# Altium project Project.PrjPCB
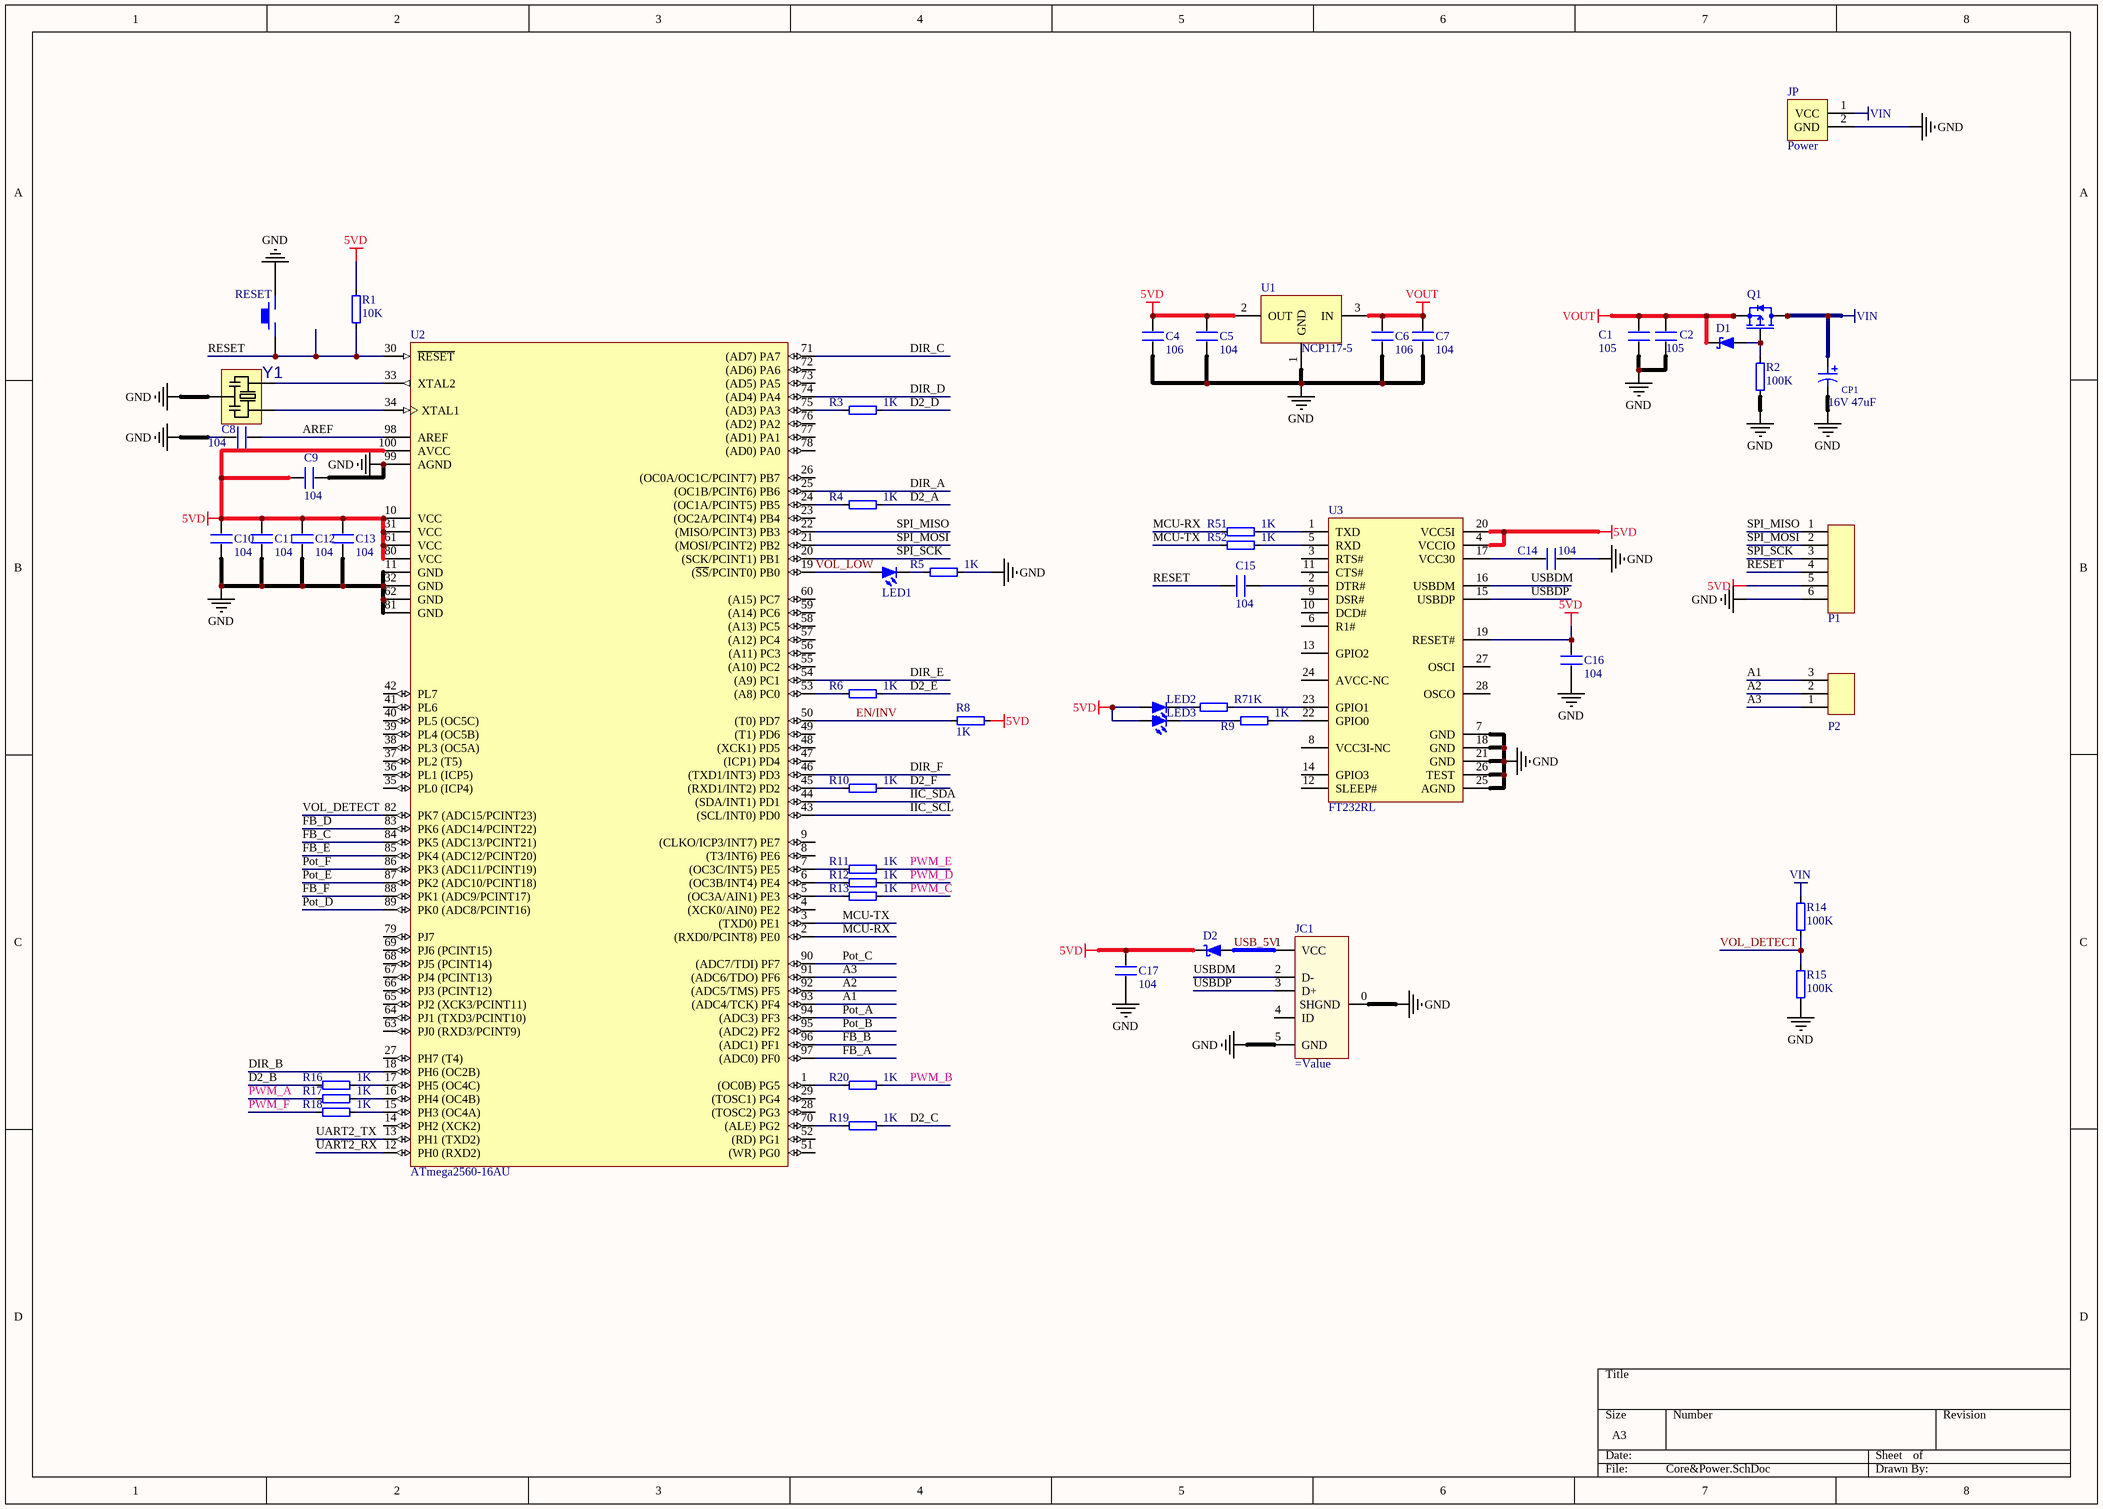
[diagram p0: Core&Power.SchDoc]
2 sheets, 132 parts. Net scope: global (net labels, ports and power ports of the same name join across sheets).
Board file: Motor.PcbDoc
Sheets:
  Core&Power.SchDoc
  Motor.SchDoc

## Sheet Core&Power.SchDoc
size A3

### Parts
C1  105  [SM0603C]
C2  105  [SM0603C]
C4  106  [SM0603C]
C5  104  [SM0603C]
C6  106  [SM0603C]
C7  104  [SM0603C]
C8  104  [SM0603C]
C9  104  [SM0603C]
C10  104  [SM0603C]
C11  104  [SM0603C]
C12  104  [SM0603C]
C13  104  [SM0603C]
C14  104  [SM0603C]
C15  104  [SM0603C]
C16  104  [SM0603C]
C17  104  [SM0603C]
CP1  16V 47uF  [SMD5-Al]
D1  B5819W  [SOD-323]  (value not drawn)
D2  B5819W  [SOD-323]  (value not drawn)
JC1  (no value)  [MICRO-USB2]
JP  Power  [AM1015-M]
LED1  Blue LED  [SM0805LED]  (value not drawn)
LED2  Blue LED  [SM0805LED]  (value not drawn)
LED3  Blue LED  [SM0805LED]  (value not drawn)
P1  JC6  [HDR1X6]  (value not drawn)
P2  JC3  [HDR1X3]  (value not drawn)
Q1  (no value)
R1  10K  [SM0603R]
R2  100K  [SM0603R]
R3  1K  [SM0603R]
R4  1K  [SM0603R]
R5  1K  [SM0603R]
R6  1K  [SM0603R]
R7  1K  [SM0603R]
R8  1K  [SM0603R]
R9  1K  [SM0603R]
R10  1K  [SM0603R]
R11  1K  [SM0603R]
R12  1K  [SM0603R]
R13  1K  [SM0603R]
R14  100K  [SM0603R]
R15  100K  [SM0603R]
R16  1K  [SM0603R]
R17  1K  [SM0603R]
R18  1K  [SM0603R]
R19  1K  [SM0603R]
R20  1K  [SM0603R]
R51  1K  [SM0603R]
R52  1K  [SM0603R]
RESET  KEY_M  [SPNO_SMD]  (value not drawn)
U1  NCP117-5  [SOT223-4]
U2  ATmega2560-16AU  [100A_N]
U3  FT232RL  [SSOP-28]
Y1  CSTCE16M0V53-R0  [OSC_CSTCE16M0V53-R0]  (value not drawn)

### Nets
5VD: C4.2 C5.2 C9.2 C10.1 C11.1 C12.1 C13.1 C16.2 C17.2 D2.1(C) LED2.2(A) LED3.2(A) P1.5 R1.2 R8.1 U1.2(OUT) U2.10(VCC) U2.31(VCC) U2.61(VCC) U2.80(VCC) U2.100(AVCC) U3.4(VCCIO) U3.19(RESET#) U3.20(VCC5I)
GND: C1.1 C2.1 C4.1 C5.1 C6.1 C7.1 C8.1 C9.1 C10.2 C11.2 C12.2 C13.2 C14.2 C16.1 C17.1 CP1.2 JC1.0(SHGND) JC1.5(GND) JP.2(GND) P1.6 R2.1 R5.2 R15.1 RESET.1 U1.1(GND) U2.11(GND) U2.32(GND) U2.62(GND) U2.81(GND) U2.99(AGND) U3.7(GND) U3.18(GND) U3.21(GND) U3.25(AGND) U3.26(TEST) Y1.2
VIN: CP1.1 JP.1(VCC) Q1.5(D) Q1.6(D) Q1.7(D) Q1.8(D) R14.2
VOUT: C1.2 C2.2 C6.2 C7.2 D1.1(C) Q1.1(S) Q1.2(S) Q1.3(S) U1.3(IN)
A1: P2.3 U2.93((ADC4/TCK)_PF4)
A2: P2.2 U2.92((ADC5/TMS)_PF5)
A3: P2.1 U2.91((ADC6/TDO)_PF6)
AREF: C8.2 U2.98(AREF)
D2_A: R4.2
D2_B: R16.2
D2_C: R19.2
D2_D: R3.2
D2_E: R6.2
D2_F: R10.2
DIR_A: U2.25((OC1B/PCINT6)_PB6)
DIR_B: U2.18(PH6_(OC2B))
DIR_C: U2.71((AD7)_PA7)
DIR_D: U2.74((AD4)_PA4)
DIR_E: U2.54((A9)_PC1)
DIR_F: U2.46((TXD1/INT3)_PD3)
EN/INV: R8.2 U2.50((T0)_PD7)
FB_A: U2.97((ADC0)_PF0)
FB_B: U2.96((ADC1)_PF1)
FB_C: U2.84(PK5_(ADC13/PCINT21))
FB_D: U2.83(PK6_(ADC14/PCINT22))
FB_E: U2.85(PK4_(ADC12/PCINT20))
FB_F: U2.88(PK1_(ADC9/PCINT17))
IIC_SCL: U2.43((SCL/INT0)_PD0)
IIC_SDA: U2.44((SDA/INT1)_PD1)
MCU-RX: R51.1 U2.2((RXD0/PCINT8)_PE0)
MCU-TX: R52.1 U2.3((TXD0)_PE1)
Pot_A: U2.94((ADC3)_PF3)
Pot_B: U2.95((ADC2)_PF2)
Pot_C: U2.90((ADC7/TDI)_PF7)
Pot_D: U2.89(PK0_(ADC8/PCINT16))
Pot_E: U2.87(PK2_(ADC10/PCINT18))
Pot_F: U2.86(PK3_(ADC11/PCINT19))
PWM_A: R17.1
PWM_B: R20.2
PWM_C: R13.2
PWM_D: R12.2
PWM_E: R11.2
PWM_F: R18.1
RESET: C15.2 P1.4 R1.1 RESET.2 U2.30(~{RESET})
SPI_MISO: P1.1 U2.22((MISO/PCINT3)_PB3)
SPI_MOSI: P1.2 U2.21((MOSI/PCINT2)_PB2)
SPI_SCK: P1.3 U2.20((SCK/PCINT1)_PB1)
UART2_RX: U2.12(PH0_(RXD2))
UART2_TX: U2.13(PH1_(TXD2))
USB_5V: D2.2(A) JC1.1(VCC)
USBDM: JC1.2(D-) U3.16(USBDM)
USBDP: JC1.3(D+) U3.15(USBDP)
VOL_DETECT: R14.1 R15.2 U2.82(PK7_(ADC15/PCINT23))
VOL_LOW: LED1.2(A) U2.19((~{SS}/PCINT0)_PB0)
NetC14_1: C14.1 U3.17(VCC30)
NetC15_1: C15.1 U3.2(DTR#)
NetD1_2: D1.2(A) Q1.4(G) R2.2
NetLED1_1: LED1.1(C) R5.1
NetLED2_1: LED2.1(C) R7.1
NetLED3_1: LED3.1(C) R9.1
NetR3_1: R3.1 U2.75((AD3)_PA3)
NetR4_1: R4.1 U2.24((OC1A/PCINT5)_PB5)
NetR6_1: R6.1 U2.53((A8)_PC0)
NetR7_2: R7.2 U3.23(GPIO1)
NetR9_2: R9.2 U3.22(GPIO0)
NetR10_1: R10.1 U2.45((RXD1/INT2)_PD2)
NetR11_1: R11.1 U2.7((OC3C/INT5)_PE5)
NetR12_1: R12.1 U2.6((OC3B/INT4)_PE4)
NetR13_1: R13.1 U2.5((OC3A/AIN1)_PE3)
NetR16_1: R16.1 U2.17(PH5_(OC4C))
NetR17_2: R17.2 U2.16(PH4_(OC4B))
NetR18_2: R18.2 U2.15(PH3_(OC4A))
NetR19_1: R19.1 U2.70((ALE)_PG2)
NetR20_1: R20.1 U2.1((OC0B)_PG5)
NetR51_2: R51.2 U3.1(TXD)
NetR52_2: R52.2 U3.5(RXD)
NetU2_33: U2.33(XTAL2) Y1.3
NetU2_34: U2.34(XTAL1) Y1.1

Not connected (* = marked no-connect by the designer): JC1 4(ID); U2 4((XCK0/AIN0)_PE2) 8((T3/INT6)_PE6) 9((CLKO/ICP3/INT7)_PE7) 14(PH2_(XCK2)) 23((OC2A/PCINT4)_PB4) 26((OC0A/OC1C/PCINT7)_PB7) 27(PH7_(T4)) 28((TOSC2)_PG3) 29((TOSC1)_PG4) 35(PL0_(ICP4)) 36(PL1_(ICP5)) 37(PL2_(T5)) 38(PL3_(OC5A)) 39(PL4_(OC5B)) 40(PL5_(OC5C)) 41(PL6) 42(PL7) 47((ICP1)_PD4) 48((XCK1)_PD5) 49((T1)_PD6) 51((WR)_PG0) 52((RD)_PG1) 55((A10)_PC2) 56((A11)_PC3) 57((A12)_PC4) 58((A13)_PC5) 59((A14)_PC6) 60((A15)_PC7) 63(PJ0_(RXD3/PCINT9)) 64(PJ1_(TXD3/PCINT10)) 65(PJ2_(XCK3/PCINT11)) 66(PJ3_(PCINT12)) 67(PJ4_(PCINT13)) 68(PJ5_(PCINT14)) 69(PJ6_(PCINT15)) 72((AD6)_PA6) 73((AD5)_PA5) 76((AD2)_PA2) 77((AD1)_PA1) 78((AD0)_PA0) 79(PJ7); U3 3(RTS#) 6(R1#) 8(VCC3I-NC) 9(DSR#) 10(DCD#) 11(CTS#) 12(SLEEP#) 13(GPIO2) 14(GPIO3) 24(AVCC-NC) 27(OSCI) 28(OSCO)

### Library data of the parts
C1 C2 C4-C17 = C
CP1 = 2.1.2.50.5162200: Cap, 22uF, 20%, 16V; Manufactory: ALUMINUM; InstallMode: SMD; Install: *; Value: 16V 47uF
D1 D2 = 2.1.4.21.0058190: Dio, Schottky, B5819W, 1A, 40V, SOD123, SSC; Manufactory: Silicon Standard Corp.; InstallMode: SMD; Install: *; Part Number: 2.1.4.21.0058190; Name: B5819W; Value: B5819W; HelpURL: http://doc.digimagus.net/doc/4 极管类/21 肖特基二极管/2.1.4.21.00581x0(B5817W-B5819W).pdf
JC1 = 2.1.7.20.6780302: Mini USB Jack, SD-67803-002, Molex; Install: *; Part Number: 2.1.7.20.6780302
LED1-LED3 = 2.1.4.10.0060330: LED, Blue, 5mA, 0603; Manufactory: Everlight Electronics Co., Ltd.; Name: Blue LED[0603]; InstallMode: SMD; Install: *; Part Number: 2.1.4.10.0060330; Value: Blue LED; HelpURL: http://doc.digimagus.net/doc/4 极管类/10 贴片LED/2.1.4.10.0060330(LED_Blue_0603).pdf
Q1 = IRF7842: Mos/P; InstallMode: SMD
R1-R20 R51 R52 = RES
U2 = ATmega2560-16AU: 8-bit AVR Microcontroller, 4.5-5.5V, 256KB Flash, 4KB EEPROM, 8KB SRAM, 86 GPIO pins, 100-pin TQFP, Industrial Grade (-40癈 to 85癈), Pb-Free; Published: 1-Apr-2010; DatasheetVersion: revL, Aug-2007; PackageVersion: revC, Oct-2001; PackageReference: 100A; Publisher: Altium Limited; PackageDescription: 100-Pin Thin Profile Plastic Quad Flat Pack (TQFP), 14 x 14 x 1.0 mm Body, 0.5 mm Pitch; Supplier 1: Digi-Key; Supplier Part Number 1: ATMEGA2560-16AU-ND; Supplier 2: Farnell; Supplier Part Number 2: 1288330; Supplier 3: Farnell; Supplier Part Number 3: 1661740; Supplier 4: Mouser; Supplier Part Number 4: 556-ATMEGA2560-16AU; Code_JEDEC: MS-026-AED; ComponentLink1Description: Manufacturer Link; ComponentLink1URL: http://www.atmel.com/products/avr/default.asp?; ComponentLink2Description: ATmega640/1280/1281/2560/2561 Datasheet; ComponentLink2URL: http://www.atmel.com/dyn/resources/prod_documents/doc2549.pdf; ComponentLink3Description: ATmega640/1280/1281/2560/2561 Summary; ComponentLink3URL: http://www.atmel.com/dyn/resources/prod_documents/2549S.pdf; ComponentLink4Description: Atmel.com Home; ComponentLink4URL: http://www.atmel.com
Y1 = CSTCE16M0V53-R0: Ceramic Resonator 16MHz ??0.5% (Tol) ??0.3% (Stability) 15pF 40Ohm 3-Pin CSMD T/R; MF: Murata; MP: CSTCE16M0V53-R0; Package: SMD-3 Murata; Price: 0.30 USD; Availability: Good

## Sheet Motor.SchDoc
size A2
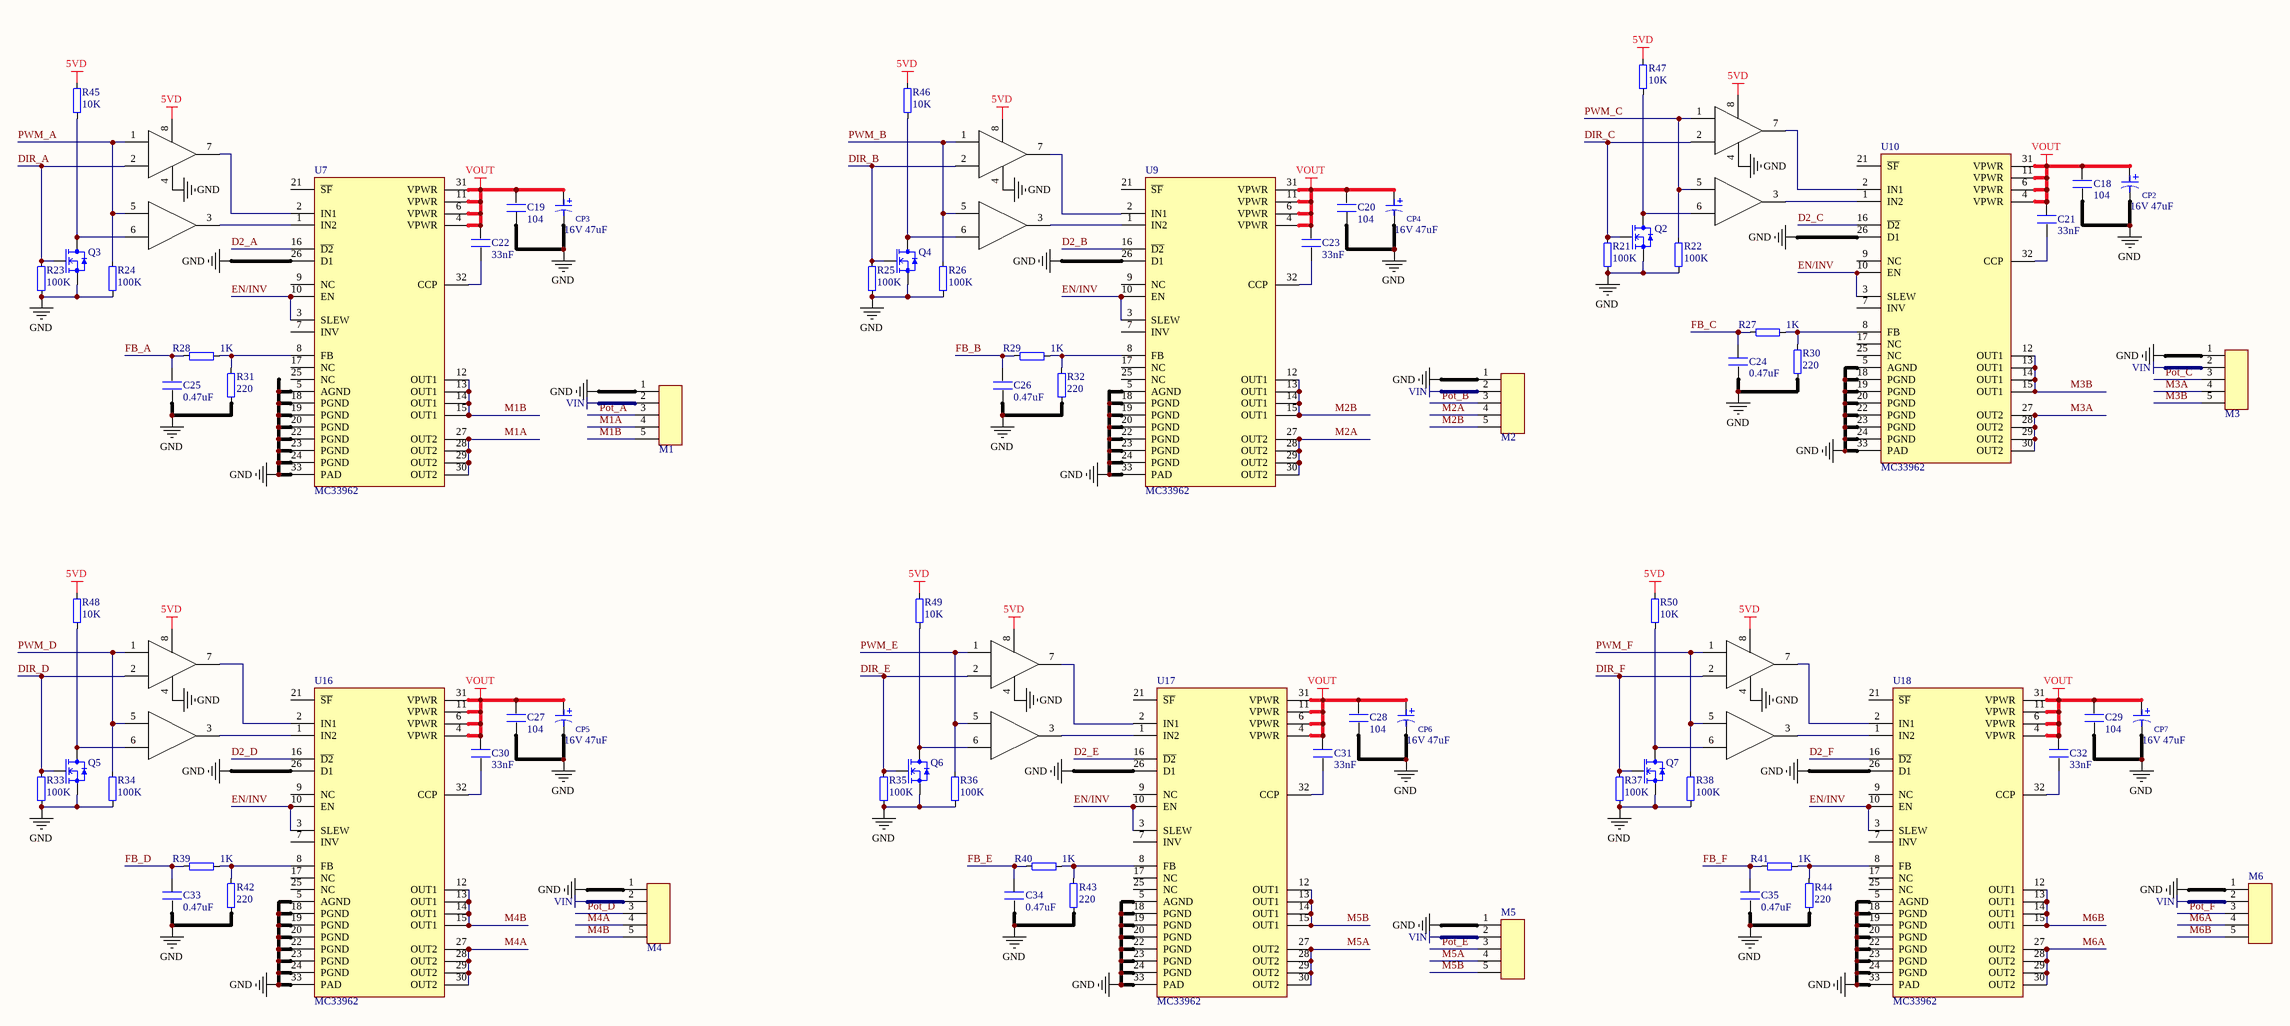
[diagram p1: Motor.SchDoc]

### Parts
C18  104  [SM0603C]
C19  104  [SM0603C]
C20  104  [SM0603C]
C21  33nF  [SM0603C]
C22  33nF  [SM0603C]
C23  33nF  [SM0603C]
C24  0.47uF  [SM0603C]
C25  0.47uF  [SM0603C]
C26  0.47uF  [SM0603C]
C27  104  [SM0603C]
C28  104  [SM0603C]
C29  104  [SM0603C]
C30  33nF  [SM0603C]
C31  33nF  [SM0603C]
C32  33nF  [SM0603C]
C33  0.47uF  [SM0603C]
C34  0.47uF  [SM0603C]
C35  0.47uF  [SM0603C]
CP2  16V 47uF  [SMD5-Al]
CP3  16V 47uF  [SMD5-Al]
CP4  16V 47uF  [SMD5-Al]
CP5  16V 47uF  [SMD5-Al]
CP6  16V 47uF  [SMD5-Al]
CP7  16V 47uF  [SMD5-Al]
M1  JC5  [FCI_SFW5R-1STE1LF]  (value not drawn)
M2  JC5  [FCI_SFW5R-1STE1LF]  (value not drawn)
M3  JC5  [FCI_SFW5R-1STE1LF]  (value not drawn)
M4  JC5  [FCI_SFW5R-1STE1LF]  (value not drawn)
M5  JC5  [FCI_SFW5R-1STE1LF]  (value not drawn)
M6  JC5  [FCI_SFW5R-1STE1LF]  (value not drawn)
Q2  2N7002  [SOT23-3]  (value not drawn)
Q3  2N7002  [SOT23-3]  (value not drawn)
Q4  2N7002  [SOT23-3]  (value not drawn)
Q5  2N7002  [SOT23-3]  (value not drawn)
Q6  2N7002  [SOT23-3]  (value not drawn)
Q7  2N7002  [SOT23-3]  (value not drawn)
R21  100K  [SM0603R]
R22  100K  [SM0603R]
R23  100K  [SM0603R]
R24  100K  [SM0603R]
R25  100K  [SM0603R]
R26  100K  [SM0603R]
R27  1K  [SM0603R]
R28  1K  [SM0603R]
R29  1K  [SM0603R]
R30  220  [SM0603R]
R31  220  [SM0603R]
R32  220  [SM0603R]
R33  100K  [SM0603R]
R34  100K  [SM0603R]
R35  100K  [SM0603R]
R36  100K  [SM0603R]
R37  100K  [SM0603R]
R38  100K  [SM0603R]
R39  1K  [SM0603R]
R40  1K  [SM0603R]
R41  1K  [SM0603R]
R42  220  [SM0603R]
R43  220  [SM0603R]
R44  220  [SM0603R]
R45  10K  [SM0603R]
R46  10K  [SM0603R]
R47  10K  [SM0603R]
R48  10K  [SM0603R]
R49  10K  [SM0603R]
R50  10K  [SM0603R]
U4  74XXX  [LC-VSSOP-8_2x2.3x05P]  (value not drawn)  (parts A,B of 2)
U5  74XXX  [LC-VSSOP-8_2x2.3x05P]  (value not drawn)  (parts A,B of 2)
U6  74XXX  [LC-VSSOP-8_2x2.3x05P]  (value not drawn)  (parts A,B of 2)
U7  MC33962  [PQFN32_0P8_8X8_SLUG]
U8  74XXX  [LC-VSSOP-8_2x2.3x05P]  (value not drawn)  (parts A,B of 2)
U9  MC33962  [PQFN32_0P8_8X8_SLUG]
U10  MC33962  [PQFN32_0P8_8X8_SLUG]
U11  74XXX  [LC-VSSOP-8_2x2.3x05P]  (value not drawn)  (parts A,B of 2)
U12  74XXX  [LC-VSSOP-8_2x2.3x05P]  (value not drawn)  (parts A,B of 2)
U16  MC33962  [PQFN32_0P8_8X8_SLUG]
U17  MC33962  [PQFN32_0P8_8X8_SLUG]
U18  MC33962  [PQFN32_0P8_8X8_SLUG]

### Nets
5VD: R45.2 R46.2 R47.2 R48.2 R49.2 R50.2 U4.8 U5.8 U6.8 U8.8 U11.8 U12.8
GND: C18.1 C19.1 C20.1 C24.2 C25.2 C26.2 C27.1 C28.1 C29.1 C33.2 C34.2 C35.2 CP2.2 CP3.2 CP4.2 CP5.2 CP6.2 CP7.2 M1.1 M2.1 M3.1 M4.1 M5.1 M6.1 Q2.2(S) Q3.2(S) Q4.2(S) Q5.2(S) Q6.2(S) Q7.2(S) R21.1 R22.1 R23.1 R24.1 R25.1 R26.1 R30.1 R31.1 R32.1 R33.1 R34.1 R35.1 R36.1 R37.1 R38.1 R42.1 R43.1 R44.1 U4.4 U5.4 U6.4 U7.5(AGND) U7.18(PGND) U7.19(PGND) U7.20(PGND) U7.22(PGND) U7.23(PGND) U7.24(PGND) U7.26(D1) U7.33(PAD) U8.4 U9.5(AGND) U9.18(PGND) U9.19(PGND) U9.20(PGND) U9.22(PGND) U9.23(PGND) U9.24(PGND) U9.26(D1) U9.33(PAD) U10.5(AGND) U10.18(PGND) U10.19(PGND) U10.20(PGND) U10.22(PGND) U10.23(PGND) U10.24(PGND) U10.26(D1) U10.33(PAD) U11.4 U12.4 U16.5(AGND) U16.18(PGND) U16.19(PGND) U16.20(PGND) U16.22(PGND) U16.23(PGND) U16.24(PGND) U16.26(D1) U16.33(PAD) U17.5(AGND) U17.18(PGND) U17.19(PGND) U17.20(PGND) U17.22(PGND) U17.23(PGND) U17.24(PGND) U17.26(D1) U17.33(PAD) U18.5(AGND) U18.18(PGND) U18.19(PGND) U18.20(PGND) U18.22(PGND) U18.23(PGND) U18.24(PGND) U18.26(D1) U18.33(PAD)
VIN: M1.2 M2.2 M3.2 M4.2 M5.2 M6.2
VOUT: C18.2 C19.2 C20.2 C21.1 C22.1 C23.1 C27.2 C28.2 C29.2 C30.1 C31.1 C32.1 CP2.1 CP3.1 CP4.1 CP5.1 CP6.1 CP7.1 U7.4(VPWR) U7.6(VPWR) U7.11(VPWR) U7.31(VPWR) U9.4(VPWR) U9.6(VPWR) U9.11(VPWR) U9.31(VPWR) U10.4(VPWR) U10.6(VPWR) U10.11(VPWR) U10.31(VPWR) U16.4(VPWR) U16.6(VPWR) U16.11(VPWR) U16.31(VPWR) U17.4(VPWR) U17.6(VPWR) U17.11(VPWR) U17.31(VPWR) U18.4(VPWR) U18.6(VPWR) U18.11(VPWR) U18.31(VPWR)
D2_A: U7.16(~{D2})
D2_B: U9.16(~{D2})
D2_C: U10.16(~{D2})
D2_D: U16.16(~{D2})
D2_E: U17.16(~{D2})
D2_F: U18.16(~{D2})
DIR_A: Q3.1(G) R23.2 U4.2
DIR_B: Q4.1(G) R25.2 U5.2
DIR_C: Q2.1(G) R21.2 U6.2
DIR_D: Q5.1(G) R33.2 U8.2
DIR_E: Q6.1(G) R35.2 U11.2
DIR_F: Q7.1(G) R37.2 U12.2
EN/INV: U7.3(SLEW) U7.10(EN) U9.3(SLEW) U9.10(EN) U10.3(SLEW) U10.10(EN) U16.3(SLEW) U16.10(EN) U17.3(SLEW) U17.10(EN) U18.3(SLEW) U18.10(EN)
FB_A: C25.1 R28.1
FB_B: C26.1 R29.1
FB_C: C24.1 R27.1
FB_D: C33.1 R39.1
FB_E: C34.1 R40.1
FB_F: C35.1 R41.1
M1A: M1.4 U7.27(OUT2) U7.28(OUT2) U7.29(OUT2) U7.30(OUT2)
M1B: M1.5 U7.12(OUT1) U7.13(OUT1) U7.14(OUT1) U7.15(OUT1)
M2A: M2.4 U9.27(OUT2) U9.28(OUT2) U9.29(OUT2) U9.30(OUT2)
M2B: M2.5 U9.12(OUT1) U9.13(OUT1) U9.14(OUT1) U9.15(OUT1)
M3A: M3.4 U10.27(OUT2) U10.28(OUT2) U10.29(OUT2) U10.30(OUT2)
M3B: M3.5 U10.12(OUT1) U10.13(OUT1) U10.14(OUT1) U10.15(OUT1)
M4A: M4.4 U16.27(OUT2) U16.28(OUT2) U16.29(OUT2) U16.30(OUT2)
M4B: M4.5 U16.12(OUT1) U16.13(OUT1) U16.14(OUT1) U16.15(OUT1)
M5A: M5.4 U17.27(OUT2) U17.28(OUT2) U17.29(OUT2) U17.30(OUT2)
M5B: M5.5 U17.12(OUT1) U17.13(OUT1) U17.14(OUT1) U17.15(OUT1)
M6A: M6.4 U18.27(OUT2) U18.28(OUT2) U18.29(OUT2) U18.30(OUT2)
M6B: M6.5 U18.12(OUT1) U18.13(OUT1) U18.14(OUT1) U18.15(OUT1)
Pot_A: M1.3
Pot_B: M2.3
Pot_C: M3.3
Pot_D: M4.3
Pot_E: M5.3
Pot_F: M6.3
PWM_A: R24.2 U4.1 U4.5
PWM_B: R26.2 U5.1 U5.5
PWM_C: R22.2 U6.1 U6.5
PWM_D: R34.2 U8.1 U8.5
PWM_E: R36.2 U11.1 U11.5
PWM_F: R38.2 U12.1 U12.5
NetC21_2: C21.2 U10.32(CCP)
NetC22_2: C22.2 U7.32(CCP)
NetC23_2: C23.2 U9.32(CCP)
NetC30_2: C30.2 U16.32(CCP)
NetC31_2: C31.2 U17.32(CCP)
NetC32_2: C32.2 U18.32(CCP)
NetQ2_3: Q2.3(D) R47.1 U6.6
NetQ3_3: Q3.3(D) R45.1 U4.6
NetQ4_3: Q4.3(D) R46.1 U5.6
NetQ5_3: Q5.3(D) R48.1 U8.6
NetQ6_3: Q6.3(D) R49.1 U11.6
NetQ7_3: Q7.3(D) R50.1 U12.6
NetR27_2: R27.2 R30.2 U10.8(FB)
NetR28_2: R28.2 R31.2 U7.8(FB)
NetR29_2: R29.2 R32.2 U9.8(FB)
NetR39_2: R39.2 R42.2 U16.8(FB)
NetR40_2: R40.2 R43.2 U17.8(FB)
NetR41_2: R41.2 R44.2 U18.8(FB)
NetU4_3: U4.3 U7.1(IN2)
NetU4_7: U4.7 U7.2(IN1)
NetU5_3: U5.3 U9.1(IN2)
NetU5_7: U5.7 U9.2(IN1)
NetU6_3: U6.3 U10.1(IN2)
NetU6_7: U6.7 U10.2(IN1)
NetU8_3: U8.3 U16.1(IN2)
NetU8_7: U8.7 U16.2(IN1)
NetU11_3: U11.3 U17.1(IN2)
NetU11_7: U11.7 U17.2(IN1)
NetU12_3: U12.3 U18.1(IN2)
NetU12_7: U12.7 U18.2(IN1)

Not connected (* = marked no-connect by the designer): U7 7(INV) 9(NC) 17(NC) 21(~{SF}) 25(NC); U9 7(INV) 9(NC) 17(NC) 21(~{SF}) 25(NC); U10 7(INV) 9(NC) 17(NC) 21(~{SF}) 25(NC); U16 7(INV) 9(NC) 17(NC) 21(~{SF}) 25(NC); U17 7(INV) 9(NC) 17(NC) 21(~{SF}) 25(NC); U18 7(INV) 9(NC) 17(NC) 21(~{SF}) 25(NC)

### Library data of the parts
C18-C35 = C
CP2-CP7 = 2.1.2.50.5162200: as CP1 on sheet Core&Power; Install: *; Value: 16V 47uF
Q2-Q7 = 2.1.4.40.0270020: Mos/N, 2N7002, 7.5 OHM, 0.5A, SOT23-3, Supertex; Manufactory: Supertex inc.; Name: N-Channel Enhancement-Mode Vertical DMOS FETs; InstallMode: SMD; Install: *; Part Number: 2.1.4.40.0270020; Value: 2N7002; HelpURL: http://doc.digimagus.net/doc/4 极管类/40 贴片场效应管(N-Channel)/2.1.4.40.0270020(2N7002).pdf
R21-R50 = RES

## Nets that join several sheets
5VD: Core&Power (24 pins), Motor (12 pins)
GND: Core&Power (36 pins), Motor (108 pins)
VIN: Core&Power (7 pins), Motor (6 pins)
VOUT: Core&Power (9 pins), Motor (42 pins)
D2_A: Core&Power (R4.2), Motor (U7.16)
D2_B: Core&Power (R16.2), Motor (U9.16)
D2_C: Core&Power (R19.2), Motor (U10.16)
D2_D: Core&Power (R3.2), Motor (U16.16)
D2_E: Core&Power (R6.2), Motor (U17.16)
D2_F: Core&Power (R10.2), Motor (U18.16)
DIR_A: Core&Power (U2.25), Motor (Q3.1 R23.2 U4.2)
DIR_B: Core&Power (U2.18), Motor (Q4.1 R25.2 U5.2)
DIR_C: Core&Power (U2.71), Motor (Q2.1 R21.2 U6.2)
DIR_D: Core&Power (U2.74), Motor (Q5.1 R33.2 U8.2)
DIR_E: Core&Power (U2.54), Motor (Q6.1 R35.2 U11.2)
DIR_F: Core&Power (U2.46), Motor (Q7.1 R37.2 U12.2)
EN/INV: Core&Power (R8.2 U2.50), Motor (12 pins)
FB_A: Core&Power (U2.97), Motor (C25.1 R28.1)
FB_B: Core&Power (U2.96), Motor (C26.1 R29.1)
FB_C: Core&Power (U2.84), Motor (C24.1 R27.1)
FB_D: Core&Power (U2.83), Motor (C33.1 R39.1)
FB_E: Core&Power (U2.85), Motor (C34.1 R40.1)
FB_F: Core&Power (U2.88), Motor (C35.1 R41.1)
Pot_A: Core&Power (U2.94), Motor (M1.3)
Pot_B: Core&Power (U2.95), Motor (M2.3)
Pot_C: Core&Power (U2.90), Motor (M3.3)
Pot_D: Core&Power (U2.89), Motor (M4.3)
Pot_E: Core&Power (U2.87), Motor (M5.3)
Pot_F: Core&Power (U2.86), Motor (M6.3)
PWM_A: Core&Power (R17.1), Motor (R24.2 U4.1 U4.5)
PWM_B: Core&Power (R20.2), Motor (R26.2 U5.1 U5.5)
PWM_C: Core&Power (R13.2), Motor (R22.2 U6.1 U6.5)
PWM_D: Core&Power (R12.2), Motor (R34.2 U8.1 U8.5)
PWM_E: Core&Power (R11.2), Motor (R36.2 U11.1 U11.5)
PWM_F: Core&Power (R18.1), Motor (R38.2 U12.1 U12.5)